# Altium schematic sheet power.SchDoc
size A3
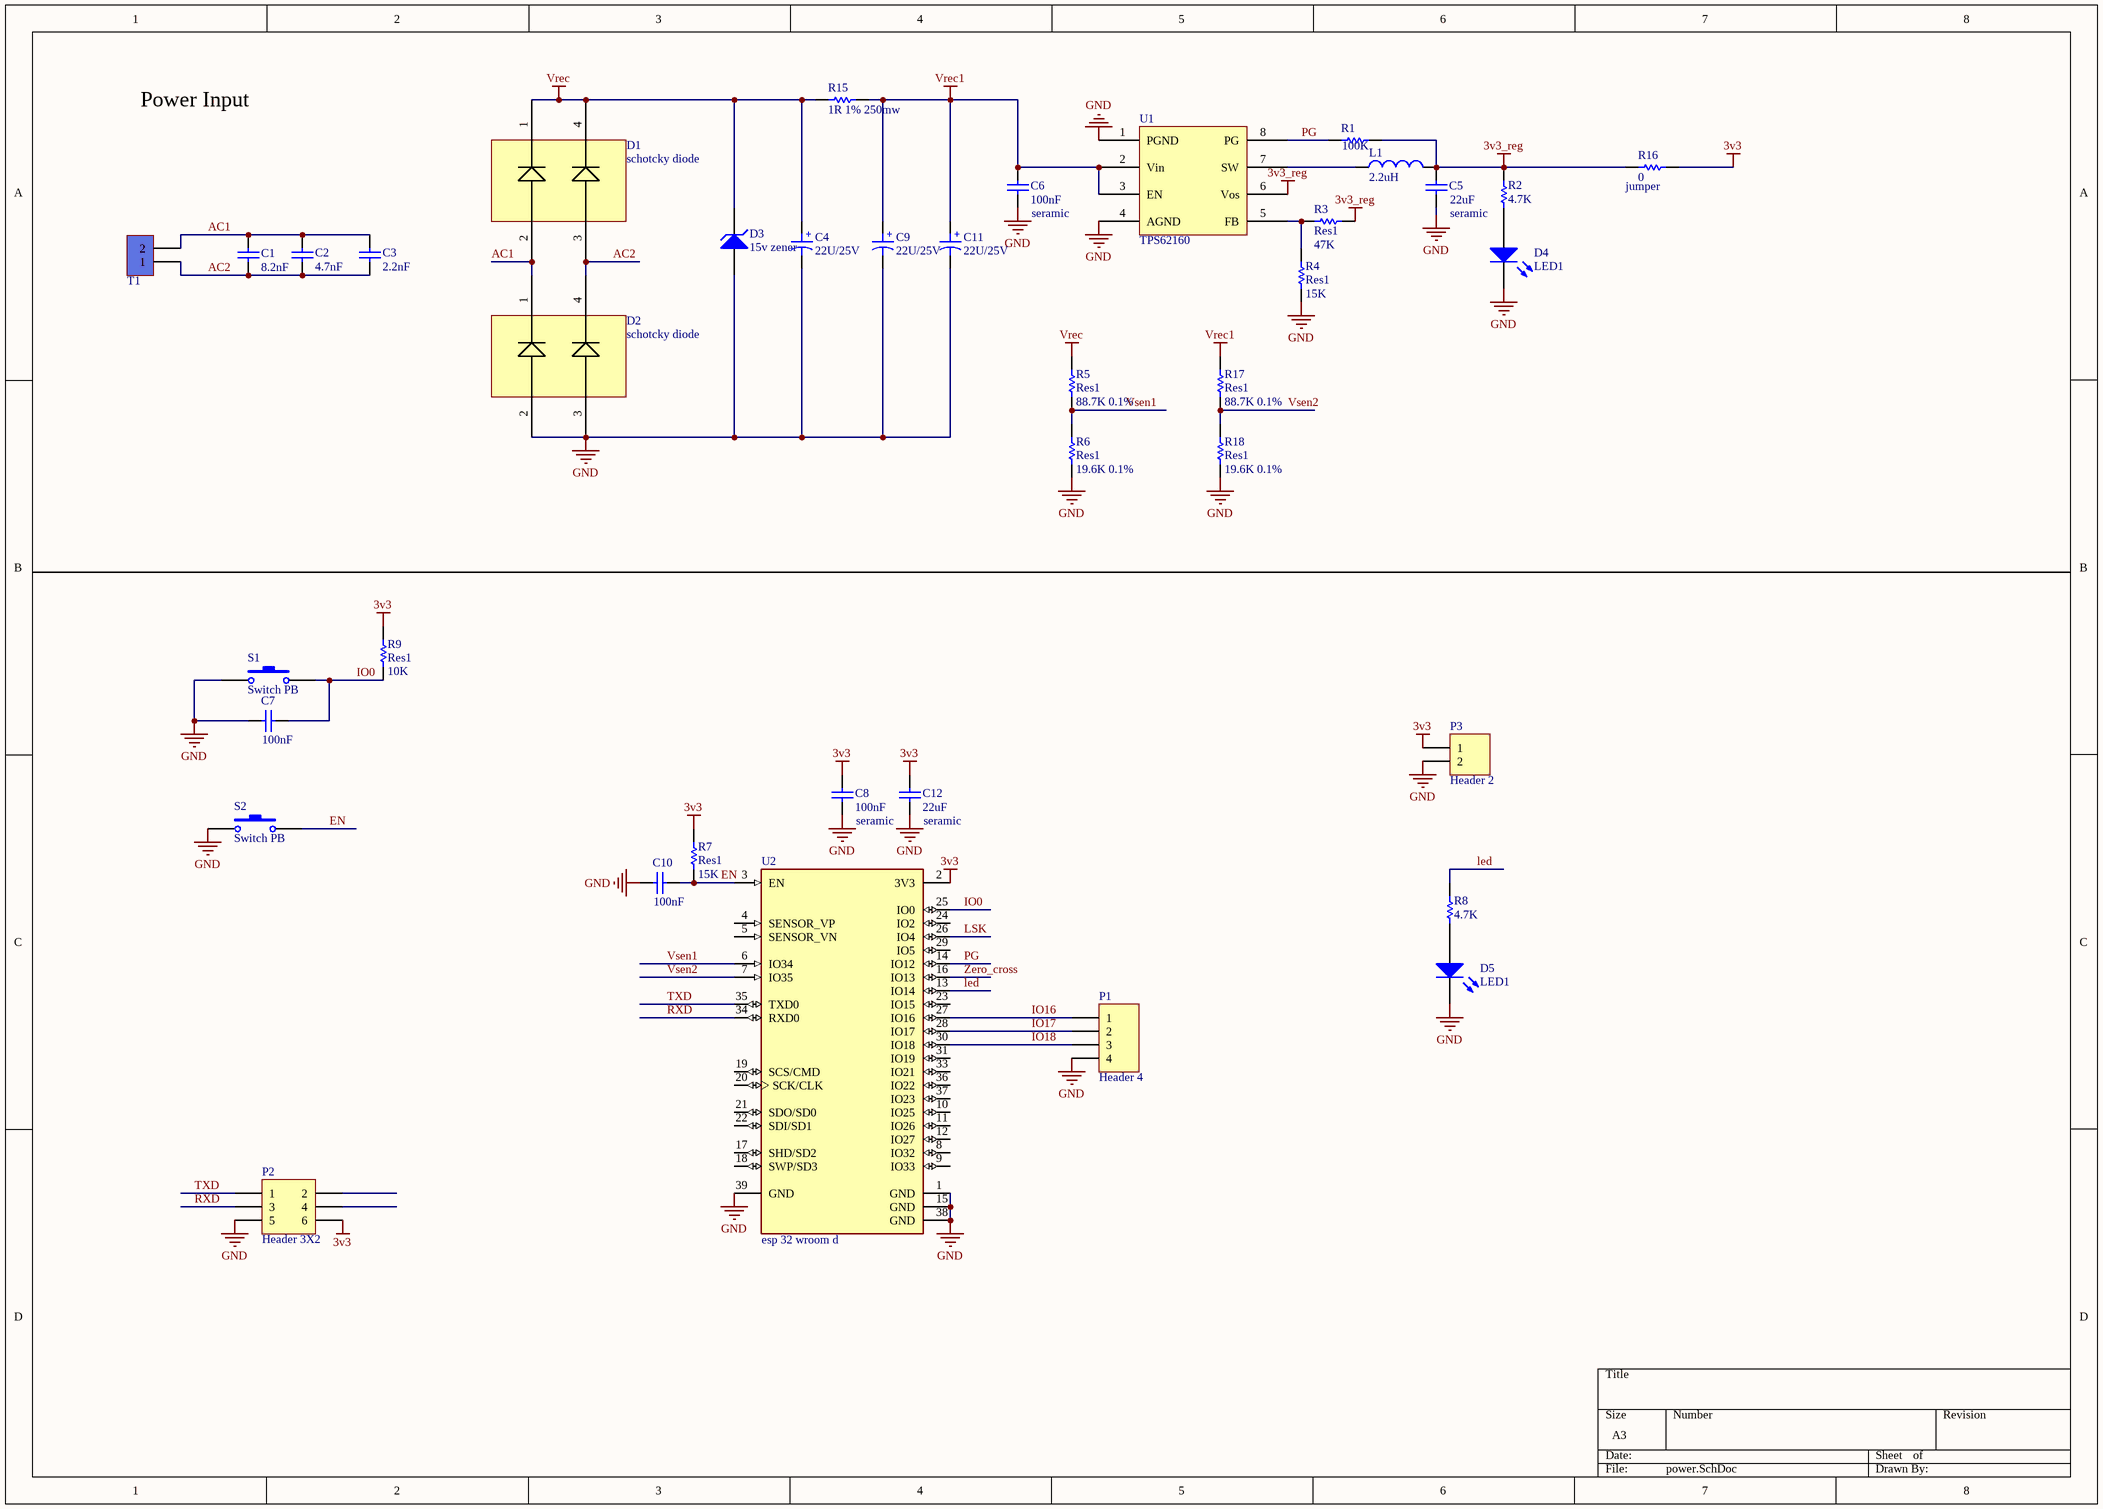
[diagram p0: power.SchDoc]

## Parts
C1  value 8.2nF  [Cap 1206 (3216X15L)]  (hidden comment: Cap)
C2  value 4.7nF  [Cap 1206 (3216X15L)]  (hidden comment: Cap)
C3  value 2.2nF  [Cap 1206 (3216X15L)]  (hidden comment: Cap)
C4  Part. No: 22U/25V  [Cap1206_(3216X18L)Size A]  (hidden comment: Cap tantal)
C5  seramic  value 22uF  [SMD_CAP_0805]
C6  seramic  value 100nF  [SMD_CAP_0805]
C7  value 100nF  [SMD_CAP_0805]  (hidden comment: seramic)
C8  seramic  value 100nF  [SMD_CAP_0805]
C9  Part. No: 22U/25V  [Cap1206_(3216X18L)Size A]  (hidden comment: Cap tantal)
C10  value 100nF  [SMD_CAP_0805]  (hidden comment: seramic)
C11  Part. No: 22U/25V  [Cap1206_(3216X18L)Size A]  (hidden comment: Cap tantal)
C12  seramic  value 22uF  [SMD_CAP_0805]
D1  schotcky diode  [UMD4]
D2  schotcky diode  [UMD4]
D3  15v zener  [Diode 1n4148 SMD]
D4  LED1  [led_0805]
D5  LED1  [led_0805]
L1  value 2.2uH  [IND1210]  (hidden comment: Inductor)
P1  Header 4  [header-1.27mm-1*4]
P2  Header 3X2  [header-1.27mm-smd-2*3]
P3  Header 2  [HDR1X2]
R1  value 100K  [RES 0805 (2012X06L)]  (hidden comment: Res1)
R2  value 4.7K  [RES 0805 (2012X06L)]  (hidden comment: Res1)
R3  Res1  value 47K  [RES 0805 (2012X06L)]
R4  Res1  value 15K  [RES 0805 (2012X06L)]
R5  Res1  value 88.7K 0.1%  [RES 0805 (2012X06L)]
R6  Res1  value 19.6K 0.1%  [RES 0805 (2012X06L)]
R7  Res1  value 15K  [RES 0805 (2012X06L)]
R8  value 4.7K  [RES 0805 (2012X06L)]  (hidden comment: Res1)
R9  Res1  value 10K  [RES 0805 (2012X06L)]
R15  value 1R 1% 250mw  [RES 1206 (3216X08L)]  (hidden comment: Res1)
R16  jumper  value 0  [Jumper]
R17  Res1  value 88.7K 0.1%  [RES 0805 (2012X06L)]
R18  Res1  value 19.6K 0.1%  [RES 0805 (2012X06L)]
S1  Switch PB  [tack-sw-3x5x6]
S2  Switch PB  [tack-sw-3x5x6]
T1  Terminal  [my-term]  (value not drawn)
U1  TPS62160  [DGK-PDSO-G8]
U2  esp 32 wroom d  [esp-wroom]

## Nets
3v3: C8.2 C12.2 P2.6 P3.1 R7.1 R9.2 R16.2 U2.2(3V3)
3v3_reg: C5.2 L1.2 R1.1 R2.1 R3.1 R16.1 U1.6(Vos)
GND: C4.2 C5.1 C6.1 C7.2 C8.1 C9.2 C10.2 C11.2 C12.1 D2.2(A1) D2.3(A2) D3.1(A) D4.2(K) D5.2(K) P1.4 P2.5 P3.2 R4.2 R6.2 R18.2 S1.1 S2.1 U1.1(PGND) U1.4(AGND) U2.1(GND) U2.15(GND) U2.38(GND) U2.39(GND)
Vrec: C4.1 D1.1(K1) D1.4(K2) D3.2(K) R5.1 R15.1
Vrec1: C6.2 C9.1 C11.1 R15.2 R17.1 U1.2(Vin) U1.3(EN)
AC1: C1.2 C2.2 C3.2 D1.2(A1) D2.1(K1) T1.2
AC2: C1.1 C2.1 C3.1 D1.3(A2) D2.4(K2) T1.1
EN: C10.1 R7.2 S2.2 U2.3(EN)
IO0: C7.1 R9.1 S1.2 U2.25(IO0)
IO16: P1.1 U2.27(IO16)
IO17: P1.2 U2.28(IO17)
IO18: P1.3 U2.30(IO18)
led: R8.1 U2.13(IO14)
LSK: U2.26(IO4)
PG: R1.2 U1.8(PG) U2.14(IO12)
RXD: P2.3 U2.34(RXD0)
TXD: P2.1 U2.35(TXD0)
Vsen1: R5.2 R6.1 U2.6(IO34)
Vsen2: R17.2 R18.1 U2.7(IO35)
Zero_cross: U2.16(IO13)
NetD4_1: D4.1(A) R2.2
NetD5_1: D5.1(A) R8.2
NetL1_1: L1.1 U1.7(SW)
NetR3_2: R3.2 R4.1 U1.5(FB)

Not connected (* = marked no-connect by the designer): P2 2 4; U2 4(SENSOR_VP) 5(SENSOR_VN) 8(IO32) 9(IO33) 10(IO25) 11(IO26) 12(IO27) 17(SHD/SD2) 18(SWP/SD3) 19(SCS/CMD) 20(SCK/CLK) 21(SDO/SD0) 22(SDI/SD1) 23(IO15) 24(IO2) 29(IO5) 31(IO19) 33(IO21) 36(IO22) 37(IO23)

## Notes on the sheet
- Power Input
- (in symbol Cap electrolitic radial 10x21) +

## Library data of the parts
C1-C3 C5-C8 C10 C12 = Cap: Capacitor; Published: 8-Jun-2000; LatestRevisionDate: 17-Jul-2002; LatestRevisionNote: Re-released for DXP Platform.; PackageReference: RAD-0.3; Publisher: Altium Limited; PackageDescription: Radial Cap, Thru-Hole; 2 Leads; 0.3 in Pin Spacing
C4 C9 C11 = Cap electrolitic radial 10x21: Designer: Abbas Basereh; Data: 16-12-2016
D1 D2 = RB481
D3 = D Zener: Zener Diode; Published: 8-Jun-2000; LatestRevisionDate: 17-Jul-2002; LatestRevisionNote: Re-released for DXP Platform.; PackageReference: DIODE-0.7; Publisher: Altium Limited; PackageDescription: Diode, Thru-Hole; 2 Leads; 0.7 in Pin Spacing
D4 D5 = LED1: Typical RED GaAs LED; Published: 8-Jun-2000; LatestRevisionDate: 08-Jul-2005; LatestRevisionNote: Mech Layer 1 removed.; PackageReference: LED-1; Publisher: Altium Limited; PackageDescription: LED; 2 Leads
L1 = Inductor: Code_IEC: 1005; Published: 8-Jun-2000; LatestRevisionDate: 29-May-2009; LatestRevisionNote: IPC-7351 Footprint Added.; PackageReference: 0402-A; Publisher: Altium Limited; PackageDescription: Chip Inductor; Code_JEITA: 0402
P1 = Header 4: Header, 4-Pin; LatestRevisionDate: 17-Jul-2002; LatestRevisionNote: Re-released for DXP Platform.; Publisher: Altium Limited
P2 = Header 3X2: Header, 3-Pin, Dual row; LatestRevisionDate: 17-Jul-2002; LatestRevisionNote: Re-released for DXP Platform.; Publisher: Altium Limited
P3 = Header 2: Header, 2-Pin; LatestRevisionDate: 17-Jul-2002; LatestRevisionNote: Re-released for DXP Platform.; Publisher: Altium Limited
R1-R9 R15-R18 = Res1: Resistor; Published: 8-Jun-2000; LatestRevisionDate: 17-Jul-2002; LatestRevisionNote: Re-released for DXP Platform.; PackageReference: AXIAL-0.3; Publisher: Altium Limited; PackageDescription: Axial Device, Thru-Hole; 2 Leads; 0.3 in Pin Spacing
S1 S2 = Switch PB: Push Button Switch
T1 = Terminal 1*2: Terminal 2 Pin 250VAC 16A; Designer: Seyed Mohsen Ghasemain; E-mail: picpars@gmail.com; ComponentLinkURL: www.picpars.com
U2 = ESP32-wroom